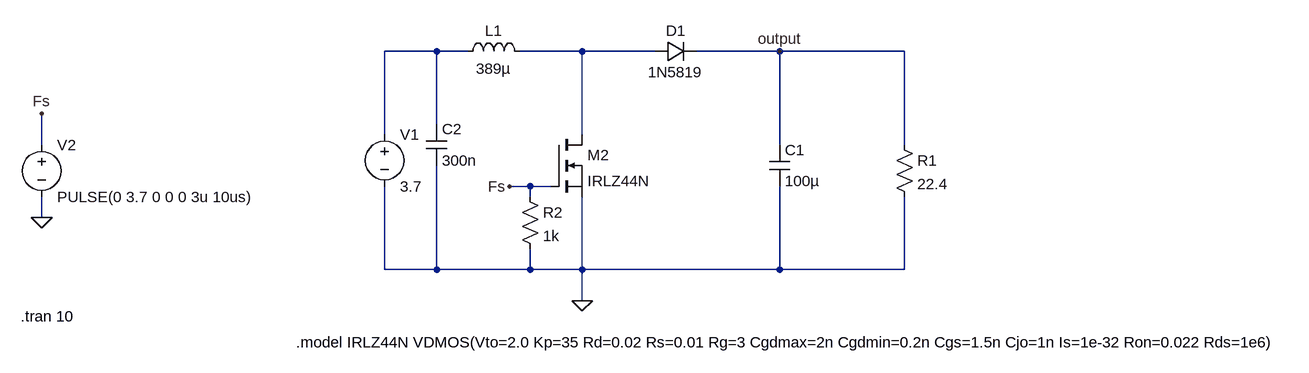
[diagram p0: schematic BOOST_CONVERTER_CIRCUIT.asc]
BOOST_CONVERTER_CIRCUIT.asc, the LTspice schematic file:
Version 4.1
SHEET 1 1712 796
WIRE 240 -32 160 -32
WIRE 288 -32 240 -32
WIRE 464 -32 368 -32
WIRE 576 -32 464 -32
WIRE 768 -32 640 -32
WIRE 960 -32 768 -32
WIRE 240 80 240 -32
WIRE 160 96 160 -32
WIRE 464 96 464 -32
WIRE -368 112 -368 64
WIRE 768 112 768 -32
WIRE 960 112 960 -32
WIRE 384 176 352 176
WIRE 416 176 384 176
WIRE 384 192 384 176
WIRE -368 224 -368 192
WIRE 160 304 160 176
WIRE 240 304 240 144
WIRE 240 304 160 304
WIRE 384 304 384 272
WIRE 384 304 240 304
WIRE 464 304 464 192
WIRE 464 304 384 304
WIRE 768 304 768 176
WIRE 768 304 464 304
WIRE 960 304 960 192
WIRE 960 304 768 304
WIRE 464 352 464 304
FLAG -368 224 0
FLAG -368 64 Fs
FLAG 352 176 Fs
FLAG 464 352 0
FLAG 768 -32 output
SYMBOL voltage 160 80 R0
WINDOW 123 0 0 Left 0
WINDOW 39 24 124 Left 2
SYMATTR InstName V1
SYMATTR Value 3.7
SYMBOL ind 272 -16 R270
WINDOW 0 32 56 VTop 2
WINDOW 3 5 56 VBottom 2
SYMATTR InstName L1
SYMATTR Value 389µ
SYMATTR SpiceLine Rser=0.05
SYMBOL cap 752 112 R0
SYMATTR InstName C1
SYMATTR Value 100µ
SYMATTR SpiceLine Rser=0.05
SYMBOL voltage -368 96 R0
WINDOW 123 0 0 Left 0
WINDOW 39 0 0 Left 0
SYMATTR InstName V2
SYMATTR Value PULSE(0 3.7 0 0 0 3u 10us)
SYMBOL diode 576 -16 R270
WINDOW 0 32 32 VTop 2
WINDOW 3 0 32 VBottom 2
SYMATTR InstName D1
SYMATTR Value 1N5819
SYMBOL res 368 176 R0
SYMATTR InstName R2
SYMATTR Value 1k
SYMBOL cap 224 80 R0
SYMATTR InstName C2
SYMATTR Value 300n
SYMATTR SpiceLine Rser=0.05
SYMBOL res 944 96 R0
SYMATTR InstName R1
SYMATTR Value 22.4
SYMBOL nmos 416 96 R0
SYMATTR InstName M2
SYMATTR Value IRLZ44N
TEXT -400 376 Left 2 !.tran 10
TEXT 24 416 Left 2 !.model IRLZ44N VDMOS(Vto=2.0 Kp=35 Rd=0.02 Rs=0.01 Rg=3 Cgdmax=2n Cgdmin=0.2n Cgs=1.5n Cjo=1n Is=1e-32 Ron=0.022 Rds=1e6)

The netlist it stands for:
* BOOST_CONVERTER_CIRCUIT.asc
V1 N001 0 3.7
L1 N001 N002 389µ Rser=0.05
C1 output 0 100µ Rser=0.05
V2 Fs 0 PULSE(0 3.7 0 0 0 3u 10us)
D1 N002 output 1N5819
R2 Fs 0 1k
C2 N001 0 300n Rser=0.05
R1 output 0 22.4
M2 N002 Fs 0 0 IRLZ44N
.model D D
.lib standard.dio
.model NMOS NMOS
.model PMOS PMOS
.lib standard.mos
.tran 10
.model IRLZ44N VDMOS(Vto=2.0 Kp=35 Rd=0.02 Rs=0.01 Rg=3 Cgdmax=2n Cgdmin=0.2n Cgs=1.5n Cjo=1n Is=1e-32 Ron=0.022 Rds=1e6)
.backanno
.end